# Altium schematic sheet SHDN-BSPD-S08-V00-Buzzer.SchDoc: Buzzer
size A3; DrawnBy: John Dillon; DocumentNumber: 8; Revision: 01; SheetNumber: 8; SheetTotal: 10
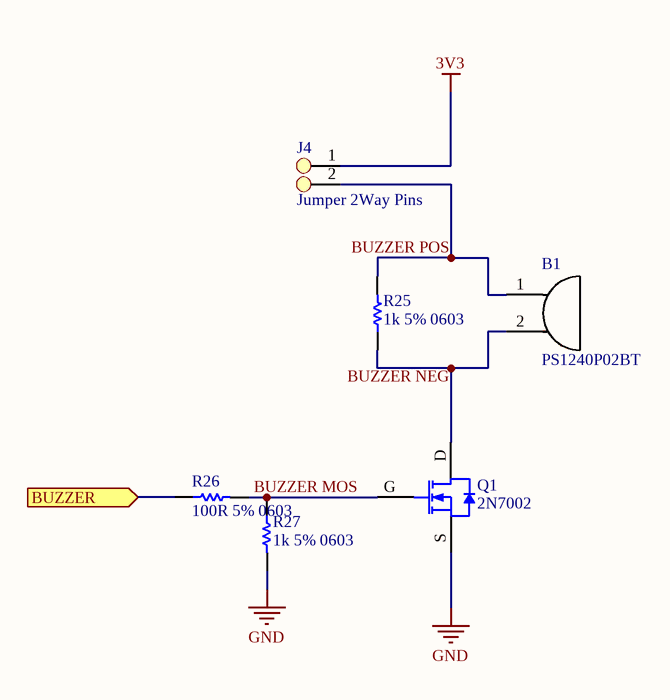
[diagram p0: SHDN-BSPD-S08-V00-Buzzer.SchDoc]

## Parts
B1  PS1240P02BT  [PS1240P02BT]
J4  Jumper 2Way Pins  [Jumper_2Way_Pin]
Q1  2N7002  [SOT23-3]
R25  1k 5% 0603  [Res_ThinFilm_0603]
R26  100R 5% 0603  [Res_ThinFilm_0603]
R27  1k 5% 0603  [Res_ThinFilm_0603]

## Ports
BUZZER (in)

## Nets
3V3: J4.1
GND: Q1.S R27.2
BUZZER: R26.1 ; port BUZZER
BUZZER MOS: Q1.G R26.2 R27.1
BUZZER NEG: B1.2 Q1.D R25.1
BUZZER POS: B1.1 J4.2 R25.2

## Notes on the sheet
- Revision History:
- Sheet Title:
- Rev
- Date
- Description
- Project:
- Size:
- Drawn By:
- A3
- Number:
- Revision:
- Sheet
- Version:
- of
- QUT Motorsport
- O-120, Gardens Point
- 2 George Street
- Brisbane, QLD 4000
- Australia
- Print Date:
- Print Time:
- File Name:

## Library data of the parts
B1 = PS1240P02BT: Buzzers Transducer, Externally Driven Piezo 3V 4kHz 60dB @ 3V, 10cm Through Hole PC Pins
J4 = Jumper 2Way Side Pins
R25 R27 = 1k 5% 0603: Resistor, SMD, 1k, 0.1W, 5%, 0603
R26 = 100R 5%, 0603: Resistor, SMD, 100R, 0.1W, 5%, 0603